# EAGLE design LAB-PPS330D (EAGLE 6.6.0)
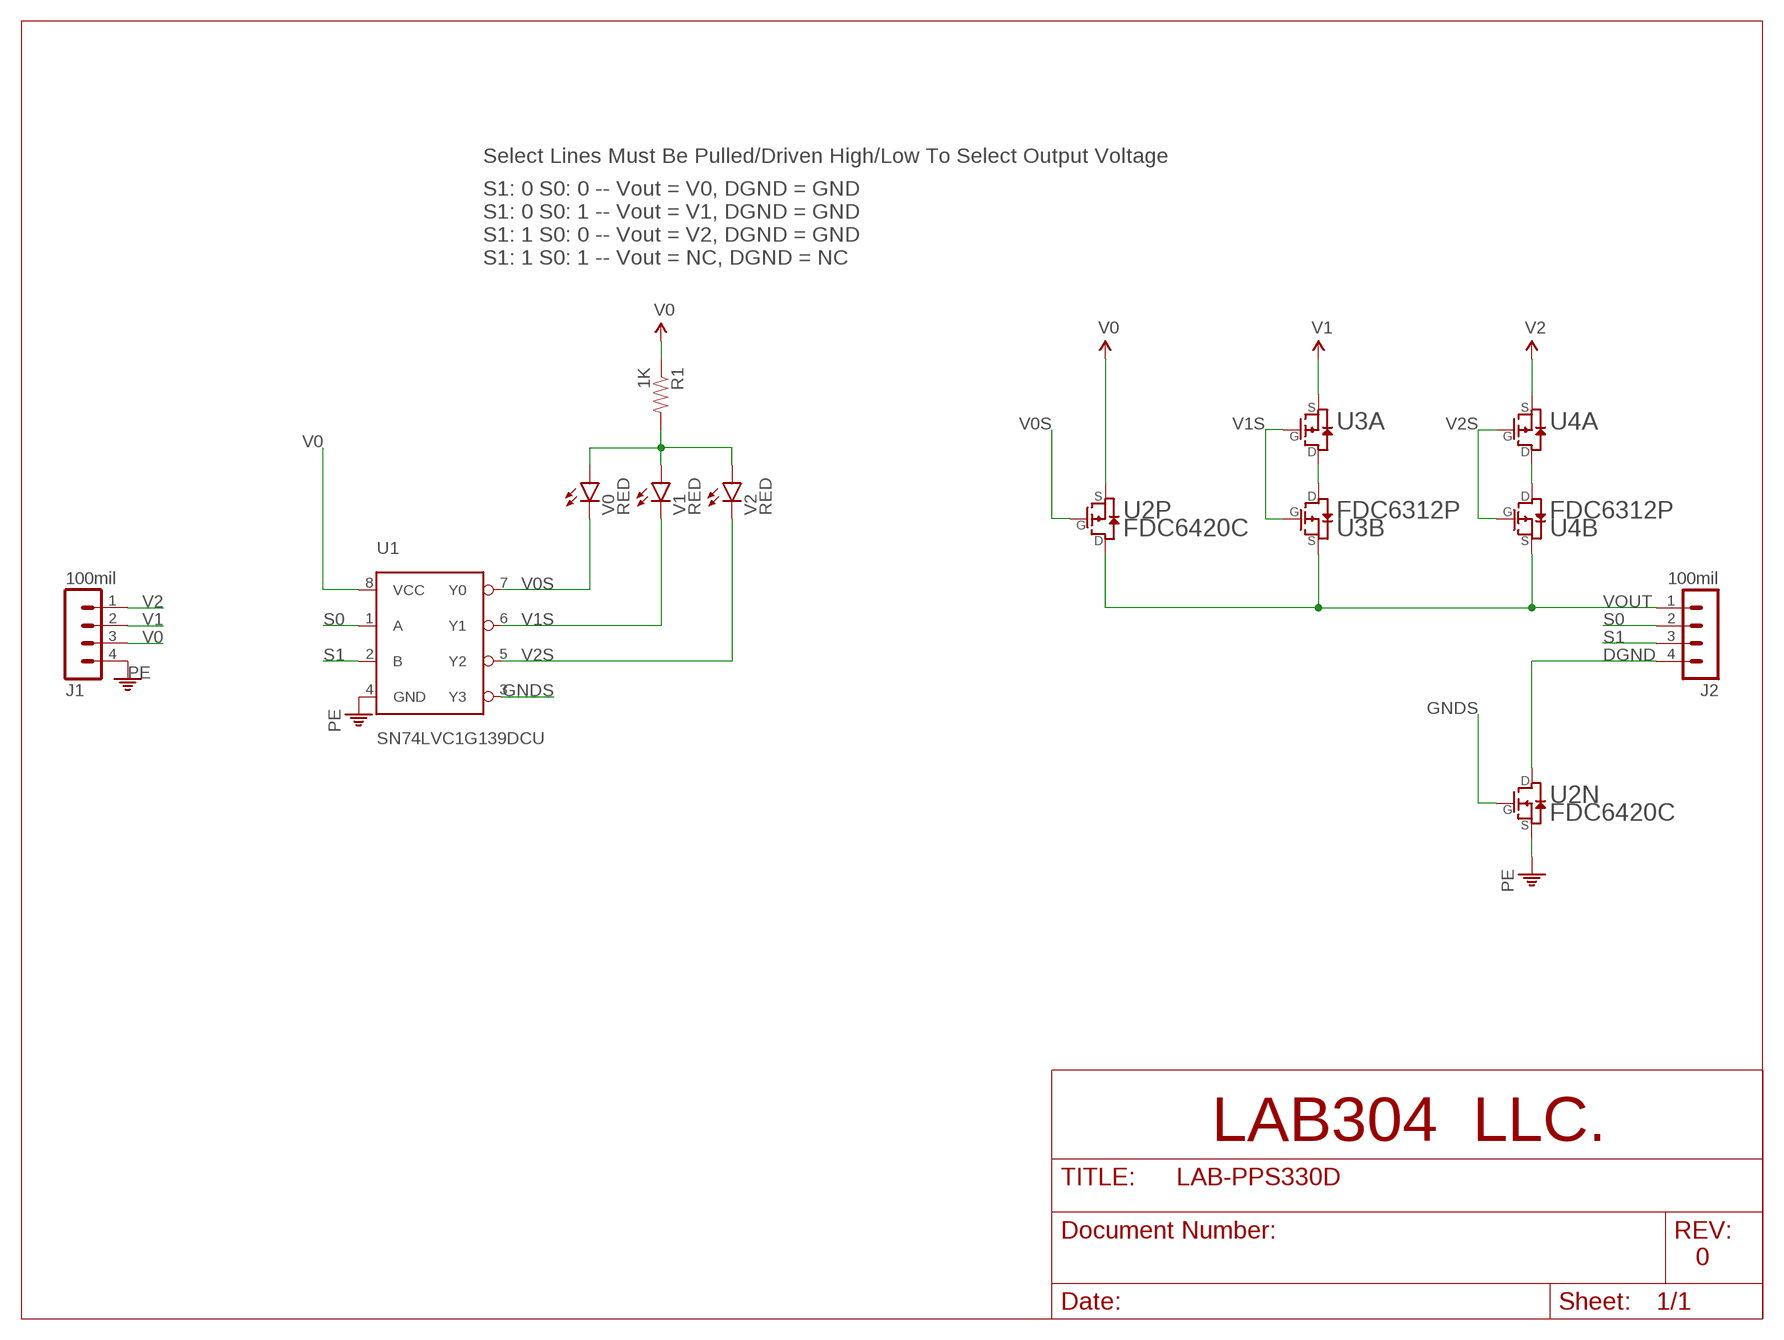
[diagram p0: schematic, sheet 1]

## Parts
J1  100mil  MA04-1  [MA04-1]
J2  100mil  MA04-1  [MA04-1]
R1  1K  1KOHM-1/10W-1%(0603)  [0603-RES]
U1  SN74LVC1G139DCU  [SOP50P310X90-8N]
U2  FDC6420C  [SOT95P270X145-6N]
U3  FDC6312P  [SOT95P270X145-6N]
U4  FDC6312P  [SOT95P270X145-6N]
V0  RED  LED-RED0603  [LED-0603]
V1  RED  LED-RED0603  [LED-0603]
V2  RED  LED-RED0603  [LED-0603]

## Nets
DGND: J2.4 U2.6(N:D)
GNDS: U1.3(Y3) U2.1(N:G)
N$1: U3.4(B:D) U3.6(A:D)
N$2: U4.4(B:D) U4.6(A:D)
N$5: R1.2 V0.A V1.A V2.A
PE: J1.4 U1.4(GND) U2.5(N:S)
S0: J2.2 U1.1(A)
S1: J2.3 U1.2(B)
V0: J1.3 R1.1 U1.8(VCC) U2.2(P:S)
V0S: U1.7(Y0) U2.3(P:G) V0.C
V1: J1.2 U3.5(A:S)
V1S: U1.6(Y1) U3.1(A:G) U3.3(B:G) V1.C
V2: J1.1 U4.5(A:S)
V2S: U1.5(Y2) U4.1(A:G) U4.3(B:G) V2.C
VOUT: J2.1 U2.4(P:D) U3.2(B:S) U4.2(B:S)

## Notes on the sheet
- Select Lines Must Be Pulled/Driven High/Low To Select Output Voltage
- S1: 0 S0: 0 -- Vout = V0, DGND = GND
  S1: 0 S0: 1 -- Vout = V1, DGND = GND
  S1: 1 S0: 0 -- Vout = V2, DGND = GND
  S1: 1 S0: 1 -- Vout = NC, DGND = NC
- LAB304  LLC.
- 0

## Library data of the parts
J1 J2 = My Library-adm:MA04-1: PIN HEADER; OC_FARNELL: unknown; OC_NEWARK: unknown
R1 = SparkFun-Resistors:1KOHM-1/10W-1%(0603): RES-07856; PROD_ID: RES-07856
U1 = LAB-PPS330D:SN74LVC1G139
U2 = LAB-PPS330D:FDC6420C
U3 U4 = LAB-PPS330D:FDC6312P
V0 V1 V2 = SparkFun-LED:LED-RED: Assorted Red LEDs LilyPad 1206- DIO-09912 1206- DIO-00809 0603- DIO-00819; PROD_ID: DIO-00819

## Board
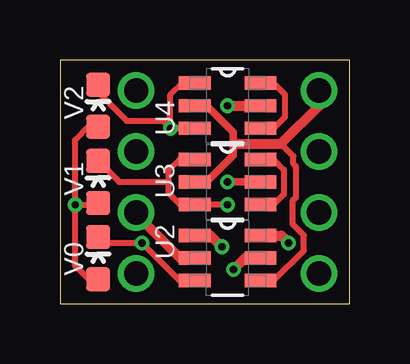
[diagram p1: board, top side]
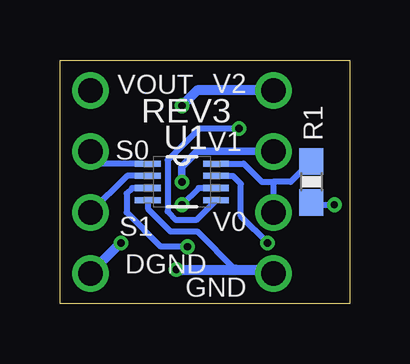
[diagram p2: board, bottom side, seen from below]

Size 12.06 x 10.16 mm. Coordinates in mm from the lower left corner, seen from the top.
Outline: 0,0 12.06,0 12.06,10.16 0,10.16 0,0
Copper layers (1*16): Top 0.035mm / dielectric 1.5mm / Bottom 0.035mm
Design rules "SeeedStudio_2layer_DRU_no_angle_20140221": minimum track width 6mil, minimum drill 12mil, track to track 6mil, track to pad 6mil, pad to pad 6mil, via to via 6mil, smd to smd 0mil, copper to edge 10mil, drill to drill 10mil, minimum pad ring 10mil, minimum via ring 6mil, stop-mask expansion 2mil, vias tented up to drill 100mil, thermal gap 10mil

### Footprints (pad centres in the part's own frame; a part is rotated, then mirrored left to right if it is on the bottom)
MA04-1 = drill 1.016: 1 -3.81,0; 2 -1.27,0; 3 1.27,0; 4 3.81,0
0603-RES = smd 1.1 x 1: 1 -0.85,0; 2 0.85,0
SOP50P310X90-8N = smd 1.067 x 0.254: 1 -1.422,0.762; 2 -1.422,0.254; 3 -1.422,-0.254; 4 -1.422,-0.762; 5 1.422,-0.762; 6 1.422,-0.254; 7 1.422,0.254; 8 1.422,0.762
SOT95P270X145-6N = smd 1.321 x 0.559: 1 -1.372,0.94; 2 -1.372,0; 3 -1.372,-0.94; 4 1.372,-0.94; 5 1.372,0; 6 1.372,0.94
LED-0603 = smd 1 x 1: A 0,-0.877; C 0,0.877

### Placement (x,y rotation side)
J1  3.17,5.08 270 top
J2  10.79,5.08 270 top
R1  1.59,5.08 270 bottom
U1  6.99,5.08 0 bottom
U2  6.99,1.91 0 top
U3  6.99,5.08 0 top
U4  6.99,8.26 0 top
V0  1.59,1.91 0 top
V1  1.59,5.08 0 top
V2  1.59,8.26 0 top

### Tracks (layer width: path | path; a pad name or v marks a point on that pad's centre or on a via)
DGND  (via drill 0.3)
  Top 0.254: 8.26,2.86 8.27,2.85 U2.6 7.92,2.85
  Top 0.406: U2.6 9.22,2.85 v9.53,2.54
  Bottom 0.406: v9.53,2.54 J2.4
GNDS  (via drill 0.3)
  Top 0.254: 5.63,2.86 U2.1
  Top 0.406: 5.63,2.86 6.27,2.86 v6.75,2.38
  Bottom 0.254: U1.3 9.06,4.83 9.29,4.6 9.29,3.81 7.86,2.38 v6.75,2.38
N$1
  Top 0.254: U3.6 8.9,6.02 9.33,5.6 9.33,4.56 8.89,4.13 8.37,4.13 U3.4
N$2
  Top 0.254: U4.4 8.9,7.32 9.37,7.78 9.37,8.73 8.9,9.2 U4.6
N$5  (via drill 0.3)
  Top 0.254: v0.64,4.13 0.64,1.59 1.19,1.03 V0.A | v0.64,4.13 0.64,6.83 1.19,7.38 V2.A | v0.64,4.13 1.51,4.13 V1.A
  Bottom 0.254: R1.2 V1.A 1.51,4.13 v0.64,4.13
PE  (via drill 0.3)
  Top 0.406: U2.5 7.7,1.91 v7.22,1.43
  Bottom 0.254: U1.4 8.41,3.96 7.46,3.02 6.35,3.02 4.76,1.43
  Bottom 0.406: v7.22,1.43 4.76,1.43 3.33,1.43 J1.4
S0
  Bottom 0.254: U1.1 10.29,5.84 J2.2
S1
  Bottom 0.254: U1.2 9.27,5.33 J2.3
V0
  Top 0.254: 3.17,3.73 J1.3
  Top 0.406: 3.17,3.73 5,1.91 U2.2
  Bottom 0.254: U1.8 4.41,5.84 3.65,5.08 3.17,5.08 | 3.17,5.08 J1.3 | R1.1 1.61,5.93 2.46,5.08 3.17,5.08
V0S  (via drill 0.3)
  Top 0.254: U2.3 4.99,0.96 v3.41,2.54 1.51,2.54 1.59,2.62 V0.C
  Bottom 0.254: U1.7 4.86,5.33 4.52,5 4.52,3.65 v3.41,2.54
V1  (via drill 0.3)
  Top 0.305: U3.5 v6.99,5.08
  Bottom 0.305: v6.99,5.08 6.99,5.71 6.35,6.35 J1.2
V1S  (via drill 0.3)
  Top 0.254: 4.52,5.08 4.52,4.6 4.99,4.14 U3.3 6.97,4.14 v6.99,4.13 | 4.52,5.08 4.52,5.56 5,6.03 5.6,6.03 U3.1 5.63,6.03 | V1.C 2.46,5.08 4.52,5.08
  Bottom 0.254: U1.6 6.29,4.83 v6.99,4.13
V2  (via drill 0.3)
  Top 0.406: v6.99,8.26 U4.5
  Bottom 0.406: J1.1 6.35,8.89 v6.99,8.26
V2S  (via drill 0.3)
  Top 0.254: 5.64,7.3 5.62,7.32 6.1,7.32 6.11,7.3 5.63,7.3 U4.3 4.62,7.32 v4.6,7.3 | V2.C 1.59,8.81 2.78,7.62 4.29,7.62 v4.6,7.3 | U4.1 5.07,9.2 4.6,8.73 v4.6,7.3
  Bottom 0.254: U1.5 6.39,3.49 7.22,3.49 7.58,3.85 7.58,5.99 6.27,7.3 v4.6,7.3
VOUT
  Top 0.254: U3.2 6.11,5.08 | U4.2 6.11,8.26 | 7.3,6.67 7.22,6.59 | 9.21,6.67 9.72,6.15 9.72,5.83 9.84,5.71 9.84,4.45 9.68,4.29 9.68,3.33 10.16,2.86 10.16,2.22 8.89,0.95 8.41,0.95 8.4,0.96 U2.4
  Top 0.305: 6.11,8.26 7.22,7.14 7.22,6.59 7.22,6.19 6.11,5.08
  Top 0.406: 7.3,6.67 9.21,6.67 10.79,8.26 J2.1

### Text on the board
bNames: V2 | VOUT | REV3 | V1 | S0 | V0 | S1 | GND | DGND